# EAGLE design keyboard_brain (EAGLE 9.6.2)
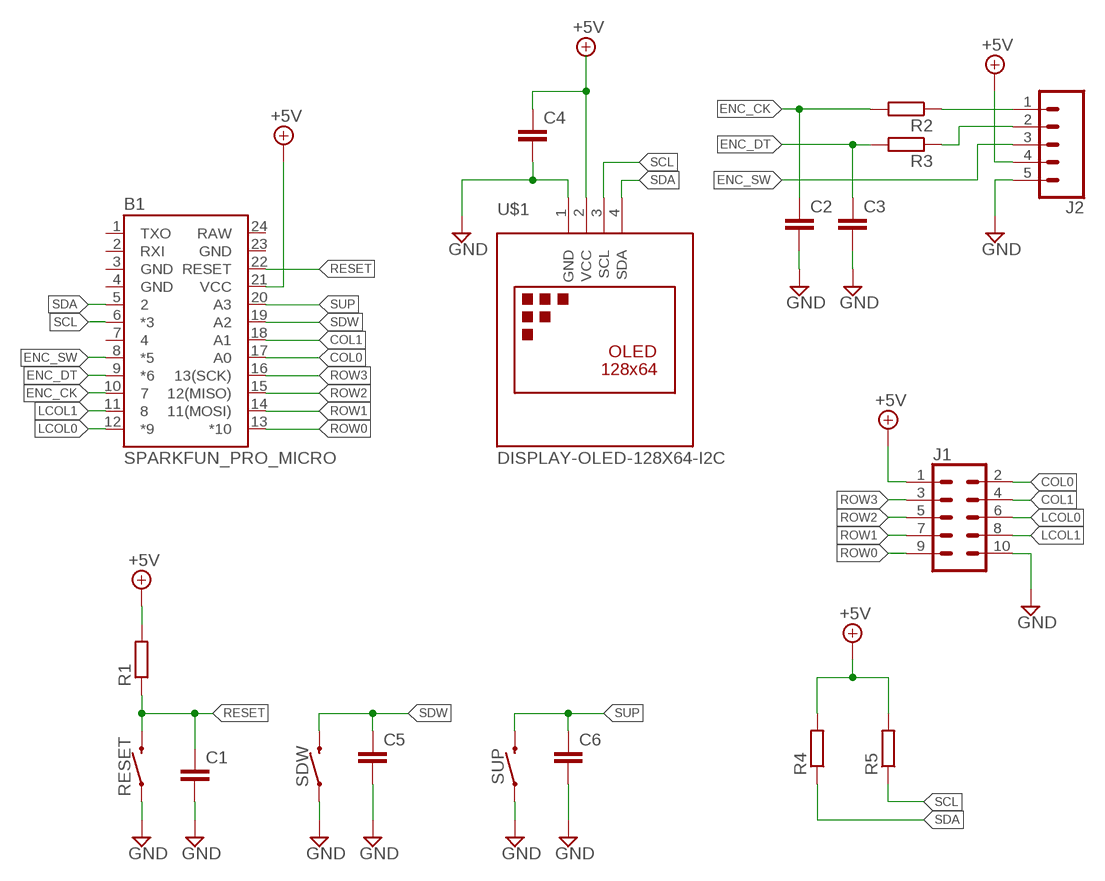
[diagram p0: schematic, sheet 1]

## Parts
B1  SPARKFUN_PRO_MICRO  [SPARKFUN_PRO_MICRO]
C1  C-EUC0603K  [C0603K]
C2  C-EUC0603K  [C0603K]
C3  C-EUC0603K  [C0603K]
C4  C-EUC0603K  [C0603K]
C5  C-EUC0603K  [C0603K]
C6  C-EUC0603K  [C0603K]
J1  CONN_05X2PTH  [2X5]
J2  CONN_05  [1X05]
R1  R-EU_R0603  [R0603]
R2  R-EU_R0603  [R0603]
R3  R-EU_R0603  [R0603]
R4  R-EU_R0603  [R0603]
R5  R-EU_R0603  [R0603]
RESET  MOMENTARY-SWITCH-SPST-PTH-6.0MM  [TACTILE_SWITCH_PTH_6.0MM]
SDW  MOMENTARY-SWITCH-SPST-SMD-5.2-REDUNDANT  [TACTILE_SWITCH_SMD_5.2MM]
SUP  MOMENTARY-SWITCH-SPST-SMD-5.2-REDUNDANT  [TACTILE_SWITCH_SMD_5.2MM]
U$1  DISPLAY-OLED-128X64-I2C  [DISPLAY-OLED-128X64-I2C]

## Nets
+5V: B1.21(VCC) C4.1 J1.1 J2.4 R1.2 R4.2 R5.2 U$1.2(VCC)
COL0: B1.17(A0) J1.2
COL1: B1.18(A1) J1.4
ENC_CK: B1.10 C2.1 R2.2
ENC_DT: B1.9(*6) C3.1 R3.2
ENC_SW: B1.8(*5) J2.3
GND: C1.2 C2.2 C3.2 C4.2 C5.2 C6.2 J1.10 J2.5 RESET.1 SDW.1 SDW.2 SUP.1 SUP.2 U$1.1(GND)
LCOL0: B1.12(*9) J1.6
LCOL1: B1.11 J1.8
N$3: J2.1 R2.1
N$4: J2.2 R3.1
RESET: B1.22(RESET) C1.1 R1.1 RESET.3
ROW0: B1.13(*10) J1.9
ROW1: B1.14(11(MOSI)) J1.7
ROW2: B1.15(12(MISO)) J1.5
ROW3: B1.16(13(SCK)) J1.3
SCL: B1.6(*3) R5.1 U$1.3(SCL)
SDA: B1.5 R4.1 U$1.4(SDA)
SDW: B1.19(A2) C5.1 SDW.3 SDW.4
SUP: B1.20(A3) C6.1 SUP.3 SUP.4
Unconnected: B1.1(TXO) B1.2(RXI) B1.7

## Power pins joined to a net without a drawn wire
GND: B1.3(GND) B1.4(GND) B1.23(GND)
RAW: B1.24(RAW)

## Library data of the parts
B1 = SparkFun-Boards:SPARKFUN_PRO_MICRO: SparkFun Pro Micro Atmega32U4 compatible footprint. SparkFun Products: 3.3V/8MHz <https://www.sparkfun.com/products/12587> 5V/16MHz <https://www.sparkfun.com/products/12640>
C1-C6 = rcl:C-EU: CAPACITOR, European symbol; SPICEPREFIX: C
J1 = SparkFun-Connectors:CONN_05X2: Multi connection point. Often used as Generic Header-pin footprint for 0.1 inch spaced/style header connections For AVR SPI programming port, see special device with nice symbol: "AVR_SPI_PROG_5x2.dev" You can populate with any combo of single row headers, but if you'd like an exact match, check these: 2x5 AVR ICSP Male Header <https://www.sparkfun.com/products/778> (PRT-00778) 2x5 Pin Shrouded Header <https://www.sparkfun.com/products/8506> (PRT-08506) On any of the 0.1 inch spaced packages, you can populate with these: Break Away Headers - Straight <https://www.sparkfun.com/products/116> (PRT-00116) Break Away Male Headers - Right Angle <https://www.sparkfun.com/products/553> (PRT-00553) Female Headers <https://www.sparkfun.com/products/115> (PRT-00115) Break Away Headers - Machine Pin <https://www.sparkfun.com/products/117> (PRT-00117) Break Away Female Headers - Swiss Machine Pin <https://www.sparkfun.com/products/743> (PRT-00743) Special note: the shrouded connector mates well with our 5x2 ribbon cables: 2x5 Pin IDC Ribbon Cable <https://www.sparkfun.com/products/8535> (PRT-08535); PROD_ID: CONN-08499; SF_ID: PRT-0778
J2 = SparkFun-Connectors:CONN_05: Multi connection point. Often used as Generic Header-pin footprint for 0.1 inch spaced/style header connections On any of the 0.1 inch spaced packages, you can populate with these: Break Away Headers - Straight <https://www.sparkfun.com/products/116> (PRT-00116) Break Away Male Headers - Right Angle <https://www.sparkfun.com/products/553> (PRT-00553) Female Headers <https://www.sparkfun.com/products/115> (PRT-00115) Break Away Headers - Machine Pin <https://www.sparkfun.com/products/117> (PRT-00117) Break Away Female Headers - Swiss Machine Pin <https://www.sparkfun.com/products/743> (PRT-00743) For SCREWTERMINALS and SPRING TERMINALS visit here: Screw Terimnals on SparkFun.com <https://www.sparkfun.com/search/results?term=Screw+Terminals> (5mm/3.5mm/2.54mm spacing) This device is also useful as a general connection point to wire up your design to another part of your project. Our various solder wires solder well into these plated through hole pads. Hook-Up Wire - Assortment (Stranded, 22 AWG) <https://www.sparkfun.com/products/11375> (PRT-11375) Hook-Up Wire - Assortment (Solid Core, 22 AWG) <https://www.sparkfun.com/products/11367> (PRT-11367) View the entire wire category on our website here <https://www.sparkfun.com/categories/141> Special notes: Molex polarized connector foot print use with SKU : PRT-08231 with associated crimp pins and housings. 1MM SMD Version SKU: PRT-10208
R1-R5 = rcl:R-EU_: RESISTOR, European symbol; SPICEPREFIX: R
RESET = SparkFun-Switches:MOMENTARY-SWITCH-SPST: Momentary Switch (Pushbutton) - SPST Normally-open (NO) SPST momentary switches (buttons, pushbuttons). Variants PTH-12MM - 12mm square, through-hole Momentary Pushbutton Switch - 12mm Square <https://www.sparkfun.com/products/9190> (COM-09190) PTH-6.0MM, PTH-6.0MM-KIT - 6.0mm square, through-hole Mini Pushbutton Switch <https://www.sparkfun.com/products/97> (COM-00097) KIT package intended for soldering kit's - only one side of pads' copper is exposed. PTH-RIGHT-ANGLE-KIT - Right-angle, through-hole Right Angle Tactile Button <https://www.sparkfun.com/products/10791> - Used on SparkFun BigTime Watch Kit <https://www.sparkfun.com/products/11734> SMD-12MM - 12mm square, surface-mount Tactile Button - SMD (12mm) <https://www.sparkfun.com/products/12993> (COM-12993) Used on SparkFun PicoBoard <https://www.sparkfun.com/products/11888> SMD-4.5MM - 4.5mm Square Trackball Switch Used on SparkFun Blackberry Trackballer Breakout <https://www.sparkfun.com/products/13169> SMD-4.6MMX2.8MM - 4.60mm x 2.80mm, surface mount Used on SparkFun SAMD21 Mini Breakout <https://www.sparkfun.com/products/13664> SMD-5.2MM, SMD-5.2-REDUNDANT - 5.2mm square, surface-mount Mini Pushbutton Switch - SMD <https://www.sparkfun.com/products/8720> (COM-08720) Used on Arduino Pro Mini <https://www.sparkfun.com/products/11114> REDUNDANT package connects both switch circuits together SMD-6.0X3.5MM - 6.0 x 3.5mm, surface mount Momentary Reset Switch SMD <https://www.sparkfun.com/products/8229> (COM-08229) SMD-6.2MM-TALL - 6.2mm square, surface mount Tactile Button - SMD (6mm) <https://www.sparkfun.com/products/12992> Used on SparkFun Digital Sandbox <https://www.sparkfun.com/products/12651> SMD-RIGHT-ANGLE - Right-angle, surface mount Used on SparkFun Block for Intel® Edison - Arduino <https://www.sparkfun.com/products/13036>; PROD_ID: SWCH-08441; SF_SKU: COM-00097
SDW SUP = SparkFun-Switches:MOMENTARY-SWITCH-SPST: Momentary Switch (Pushbutton) - SPST Normally-open (NO) SPST momentary switches (buttons, pushbuttons). Variants PTH-12MM - 12mm square, through-hole Momentary Pushbutton Switch - 12mm Square <https://www.sparkfun.com/products/9190> (COM-09190) PTH-6.0MM, PTH-6.0MM-KIT - 6.0mm square, through-hole Mini Pushbutton Switch <https://www.sparkfun.com/products/97> (COM-00097) KIT package intended for soldering kit's - only one side of pads' copper is exposed. PTH-RIGHT-ANGLE-KIT - Right-angle, through-hole Right Angle Tactile Button <https://www.sparkfun.com/products/10791> - Used on SparkFun BigTime Watch Kit <https://www.sparkfun.com/products/11734> SMD-12MM - 12mm square, surface-mount Tactile Button - SMD (12mm) <https://www.sparkfun.com/products/12993> (COM-12993) Used on SparkFun PicoBoard <https://www.sparkfun.com/products/11888> SMD-4.5MM - 4.5mm Square Trackball Switch Used on SparkFun Blackberry Trackballer Breakout <https://www.sparkfun.com/products/13169> SMD-4.6MMX2.8MM - 4.60mm x 2.80mm, surface mount Used on SparkFun SAMD21 Mini Breakout <https://www.sparkfun.com/products/13664> SMD-5.2MM, SMD-5.2-REDUNDANT - 5.2mm square, surface-mount Mini Pushbutton Switch - SMD <https://www.sparkfun.com/products/8720> (COM-08720) Used on Arduino Pro Mini <https://www.sparkfun.com/products/11114> REDUNDANT package connects both switch circuits together SMD-6.0X3.5MM - 6.0 x 3.5mm, surface mount Momentary Reset Switch SMD <https://www.sparkfun.com/products/8229> (COM-08229) SMD-6.2MM-TALL - 6.2mm square, surface mount Tactile Button - SMD (6mm) <https://www.sparkfun.com/products/12992> Used on SparkFun Digital Sandbox <https://www.sparkfun.com/products/12651> SMD-RIGHT-ANGLE - Right-angle, surface mount Used on SparkFun Block for Intel® Edison - Arduino <https://www.sparkfun.com/products/13036>; PROD_ID: SWCH-08247; SF_SKU: COM-08720
U$1 = diy-modules_oled:DISPLAY-OLED-128X64-I2C: 128x64 Dot Matrix OLED Module based on SSD1306 chip Variant with I2C interface More details available here: http://www.instructables.com/id/Monochrome-096-i2c-OLED-display-with-arduino-SSD13/ SSD1306 datasheet: https://cdn-shop.adafruit.com/datasheets/SSD1306.pdf Click here to find device on ebay.com <http://www.ebay.com/sch/oled+display+128x64+iic> Note: There are two variants: I2C and SPI. Search for the proper version.

## Board
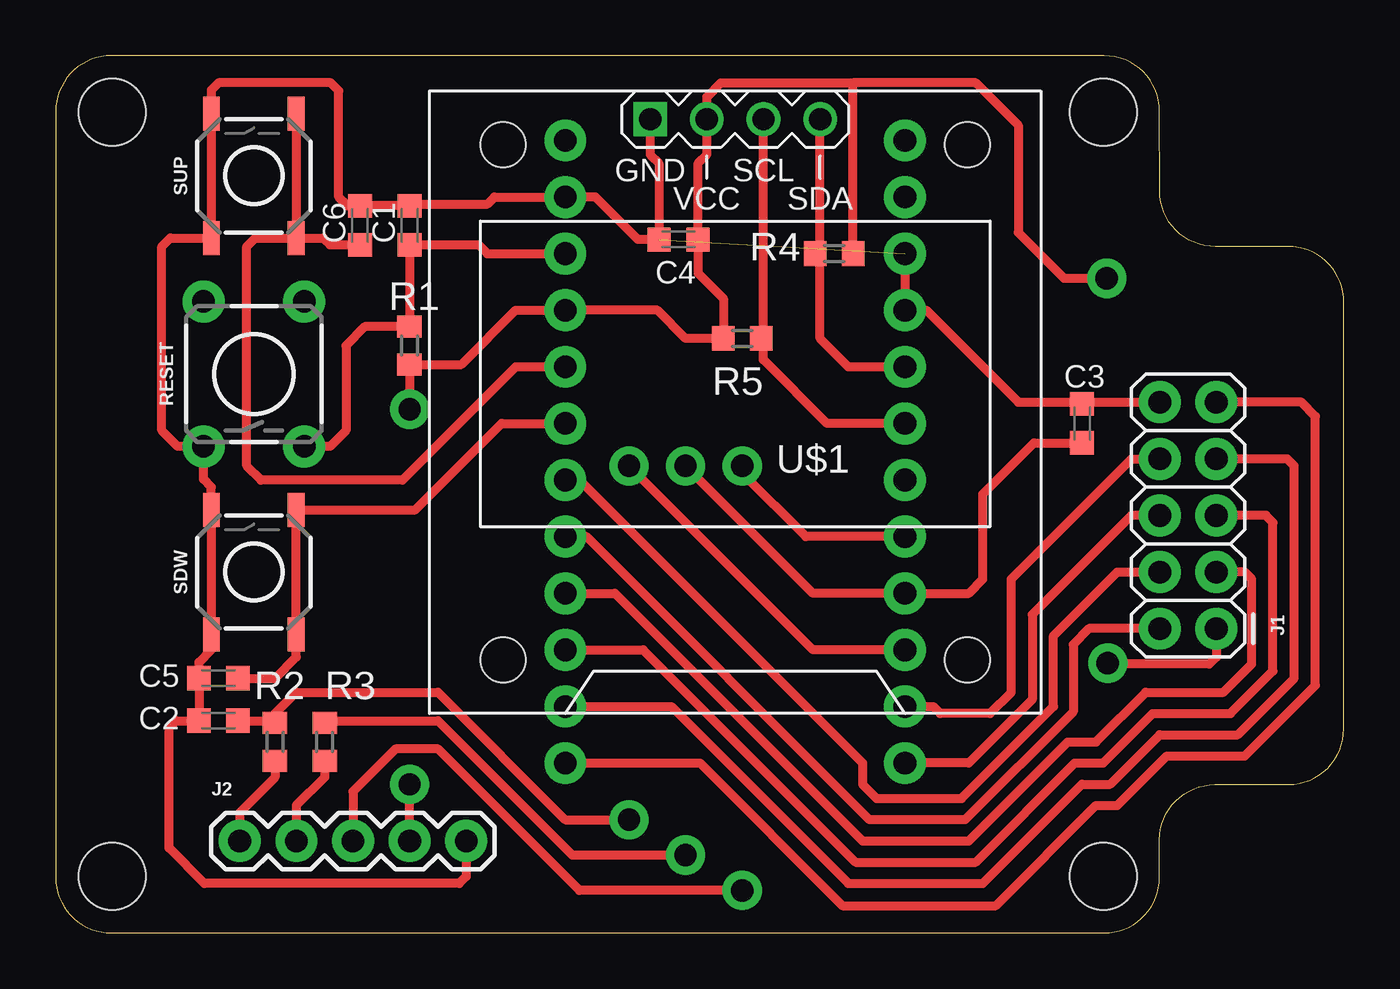
[diagram p1: board, top side]
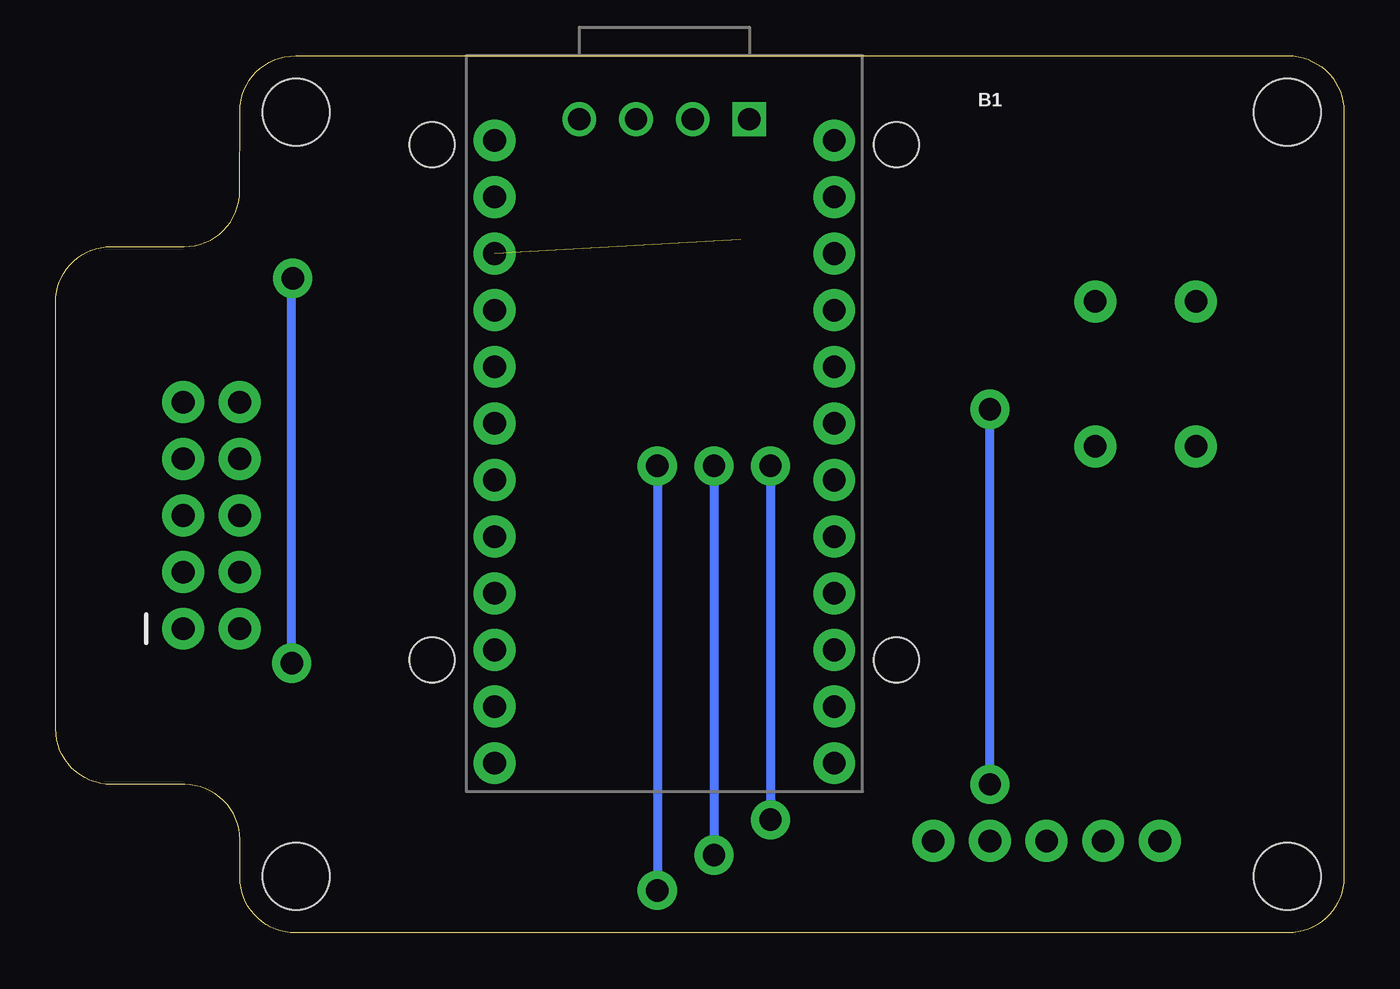
[diagram p2: board, bottom side, seen from below]

Size 57.78 x 39.36 mm. Coordinates in mm from the lower left corner, seen from the top.
Outline: 0,36.87 0,2.49 arc90 2.49,0 47.03,0 arc90 49.52,2.49 49.52,4.17 arc-90 52,6.66 55.3,6.66 arc90 57.78,9.15 57.78,28.31 arc90 55.3,30.8 52.02,30.8 arc-90 49.53,33.28 49.52,36.88 arc90 47.03,39.36 2.49,39.36 arc90 0,36.87
Copper layers (1*16): Top 0.035mm / dielectric 1.5mm / Bottom 0.035mm
Design rules "default": minimum track width 6mil, minimum drill 0.35mm, track to track 6mil, track to pad 6mil, pad to pad 6mil, via to via 6mil, smd to smd 6mil, copper to edge 40mil, drill to drill 6mil, minimum pad ring 10mil, minimum via ring 8mil, stop-mask expansion 4mil, vias tented up to drill 0mil, thermal gap 10mil
Holes 3 mm at 2.54,36.83 2.54,2.54 46.99,2.54 46.99,36.83

### Footprints (pad centres in the part's own frame; a part is rotated, then mirrored left to right if it is on the bottom)
SPARKFUN_PRO_MICRO = drill 1.016 pad 1.88: 1 -7.62,12.7; 2 -7.62,10.16; 3 -7.62,7.62; 4 -7.62,5.08; 5 -7.62,2.54; 6 -7.62,0; 7 -7.62,-2.54; 8 -7.62,-5.08; 9 -7.62,-7.62; 10 -7.62,-10.16; 11 -7.62,-12.7; 12 -7.62,-15.24; 13 7.62,-15.24; 14 7.62,-12.7; 15 7.62,-10.16; 16 7.62,-7.62; 17 7.62,-5.08; 18 7.62,-2.54; 19 7.62,0; 20 7.62,2.54; 21 7.62,5.08; 22 7.62,7.62; 23 7.62,10.16; 24 7.62,12.7
C0603K = smd 1.05 x 1.08: 1 -0.875,0; 2 0.875,0
2X5 = drill 1.016 pad 1.88: 1 0,0; 2 0,2.54; 3 2.54,0; 4 2.54,2.54; 5 5.08,0; 6 5.08,2.54; 7 7.62,0; 8 7.62,2.54; 9 10.16,0; 10 10.16,2.54
1X05 = drill 1.016 pad 1.88: 1 0,0; 2 2.54,0; 3 5.08,0; 4 7.62,0; 5 10.16,0
R0603 = smd 1 x 1.1: 1 -0.85,0; 2 0.85,0
TACTILE_SWITCH_PTH_6.0MM = drill 1.016 pad 1.88: 1 -3.251,2.261; 2 3.251,2.261; 3 -3.251,-2.261; 4 3.251,-2.261
TACTILE_SWITCH_SMD_5.2MM = smd 1.524 x 0.762: 1 -2.794,1.905; 2 2.794,1.905; 3 -2.794,-1.905; 4 2.794,-1.905
DISPLAY-OLED-128X64-I2C = drill 1 square: 1 -3.81,12.7 | drill 1: 2 -1.27,12.7; 3 1.27,12.7; 4 3.81,12.7 | hole 2: -10.414,11.557; 10.414,11.557; 10.414,-11.557; -10.414,-11.557

### Placement (x,y rotation side)
B1  30.48,22.86 0 bottom
C1  15.88,31.75 90 top
C2  7.3,9.53 180 top
C3  46.04,22.86 90 top
C4  27.94,31.11 180 top
C5  7.3,11.43 180 top
C6  13.65,31.75 90 top
J1  52.07,13.65 90 top
J2  8.26,4.13 0 top
R1  15.88,26.35 270 top
R2  9.84,8.57 90 top
R3  12.06,8.57 90 top
R4  34.92,30.48 0 top
R5  30.8,26.67 180 top
RESET  8.89,25.08 90 top
SDW  8.89,16.19 90 top
SUP  8.89,33.97 90 top
U$1  30.48,23.81 0 top

### Tracks (layer width: path | path; a pad name or v marks a point on that pad's centre or on a via)
+5V  (via drill 1 pad 1.75)
  Top 0.406: J1.1 52.07,12.38 51.75,12.06 47.23,12.06 v47.19,12.11 | v47.15,29.37 45.24,29.37 43.18,31.43 43.18,36.24 41.27,38.14 35.77,38.14 | 35.77,38.14 29.84,38.14 29.21,37.51 U$1.2 29.21,34.93 28.82,34.53 C4.1 28.82,29.61 29.95,28.47 R5.2 28.26,26.67 26.99,27.94 B1.21 20.64,27.94 18.2,25.5 R1.2 v15.88,23.5 | J2.4 v15.88,6.67 | R4.2 35.77,38.14
  Bottom 0.406: v47.19,12.11 47.19,29.41 v47.15,29.37 | v15.88,6.67 v15.88,23.5
COL0
  Top 0.406: J1.2 46.35,13.65 45.64,12.94 45.64,9.93 40.8,5.08 36.51,5.08 23.81,17.78 B1.17
COL1
  Top 0.406: B1.18 23.5,20.32 36.2,7.62 36.2,6.67 36.83,6.03 40.64,6.03 44.77,10.16 44.77,13.33 47.62,16.19 J1.4
ENC_CK  (via drill 1 pad 1.75)
  Top 0.406: B1.10 33.97,12.7 v25.72,20.95 | v25.72,5.08 22.86,5.08 17.14,10.79 10.79,10.79 9.84,9.84 R2.2 9.74,9.53 C2.1
  Bottom 0.406: v25.72,20.95 v25.72,5.08
ENC_DT  (via drill 1 pad 1.75)
  Top 0.406: v28.26,20.95 33.97,15.24 B1.9 40.96,15.24 41.59,15.88 41.59,19.68 43.89,21.98 C3.1 | v28.26,3.49 23.18,3.49 17.14,9.53 12.17,9.53 R3.2
  Bottom 0.406: v28.26,20.95 v28.26,3.49
ENC_SW  (via drill 1 pad 1.75)
  Top 0.406: B1.8 33.66,17.78 30.8,20.64 v30.8,20.95 | v30.8,1.91 23.5,1.91 17.14,8.26 15.24,8.26 13.34,6.35 J2.3
  Bottom 0.406: v30.8,20.95 v30.8,1.91
GND  (1 unrouted)
  Top 0.406: B1.3 B1.4 39.05,27.94 43.18,23.81 45.96,23.81 | J2.5 18.41,2.54 18.1,2.22 6.67,2.22 5.08,3.81 5.08,9.21 5.4,9.53 C2.2 C5.2 6.43,12.14 6.99,12.7 SDW.1 SDW.2 6.99,20 6.63,20.36 RESET.1 5.47,21.83 4.76,22.54 4.76,30.8 5.14,31.18 SUP.1 SUP.2 6.99,37.82 7.3,38.14 12.34,38.14 12.7,37.78 12.7,33.02 13.1,32.62 C6.2 C1.2 15.95,32.7 19.37,32.7 19.68,33.02 B1.23 24.21,33.02 26.11,31.11 C4.2 27.07,34.53 26.67,34.93 U$1.1 | 45.96,23.81 J1.10 | C3.2 45.96,23.81
LCOL0
  Top 0.406: J1.6 48.26,18.73 43.81,14.29 43.81,10.48 40.96,7.62 B1.12
LCOL1
  Top 0.406: B1.11 39.37,10.16 39.69,9.84 41.91,9.84 42.86,10.79 42.86,15.88 48.26,21.27 J1.8
N$3
  Top 0.406: R2.1 9.84,6.98 8.26,5.4 J2.1
N$4
  Top 0.406: R3.1 12.06,6.98 10.79,5.71 J2.2
RESET
  Top 0.406: B1.22 19.37,30.48 18.97,30.88 C1.1 R1.1 13.87,27.2 13.02,26.35 13.02,22.54 12.31,21.83 RESET.3
ROW0
  Top 0.406: B1.13 28.89,7.62 35.29,1.22 42.18,1.22 46.67,5.71 47.62,5.71 49.85,7.94 53.34,7.94 56.52,11.11 56.52,23.18 55.88,23.81 J1.9
ROW1
  Top 0.406: B1.14 27.62,10.16 35.56,2.22 41.59,2.22 46.04,6.67 47.31,6.67 49.53,8.89 53.02,8.89 55.56,11.43 55.56,20.95 55.24,21.27 J1.7
ROW2
  Top 0.406: B1.15 26.35,12.7 35.88,3.17 41.27,3.17 45.72,7.62 46.99,7.62 49.21,9.84 52.7,9.84 54.61,11.75 54.61,18.41 54.29,18.73 J1.5
ROW3
  Top 0.406: B1.16 25.08,15.24 36.2,4.13 40.96,4.13 45.4,8.57 46.67,8.57 48.9,10.79 52.39,10.79 53.66,12.06 53.66,15.88 53.34,16.19 J1.3
SCL
  Top 0.406: B1.6 34.61,22.86 31.75,25.72 31.75,26.67 | 31.75,26.67 31.75,28.26 U$1.3 | R5.1 31.75,26.67
SDA
  Top 0.406: B1.5 35.56,25.4 34.29,26.67 34.29,30.48 | 34.29,30.48 U$1.4 | R4.1 34.29,30.48
SDW
  Top 0.406: B1.19 20,22.86 16.13,18.99 SDW.4 SDW.3 10.79,12.38 9.84,11.43 C5.1
SUP
  Top 0.406: B1.20 20.64,25.4 15.56,20.32 9.21,20.32 8.57,20.95 8.57,30.8 8.95,31.18 SUP.3 | SUP.4 SUP.3 | SUP.3 12,31.18 12.3,30.88 C6.1